# EAGLE design usb-module (EAGLE 7.5.0)
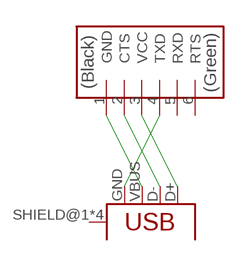
[diagram p0: schematic, sheet 1]

## Parts
U$1  USB_MINIB  [USB_MINIB]
U$3  FTDI-SMD-HEADER  [1X06SMD]

## Nets
N$1: U$1.GND U$3.4(TXD)
N$2: U$1.VBUS U$3.1(GND)
N$3: U$1.D- U$3.2(CTS)
N$4: U$1.D+ U$3.3(VCC)
Unconnected: U$1.SHIELD@1(SHIELD) U$1.SHIELD@2(SHIELD) U$1.SHIELD@3(SHIELD) U$1.SHIELD@4(SHIELD) U$3.5(RXD) U$3.6(RTS)

## Library data of the parts
U$1 = fab:USB_MINIB
U$3 = fab:FTDI-SMD-HEADER

## Board
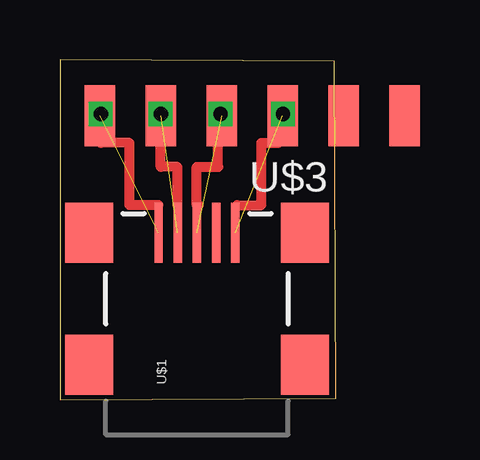
[diagram p1: board, top side]

Size 11.5 x 14.15 mm. Coordinates in mm from the lower left corner, seen from the top.
Outline: 0,0 11.5,0.05 11.45,14.1 0,14.15 0,0
Copper layers (1*16): Top 0.035mm / dielectric 1.5mm / Bottom 0.035mm
Design rules "default": minimum track width 10mil, minimum drill 24mil, track to track 8mil, track to pad 8mil, pad to pad 8mil, via to via 8mil, smd to smd 8mil, copper to edge 40mil, drill to drill 8mil, minimum pad ring 10mil, minimum via ring 8mil, stop-mask expansion 4mil, vias tented up to drill 0mil, thermal gap 10mil

### Footprints (pad centres in the part's own frame; a part is rotated, then mirrored left to right if it is on the bottom)
USB_MINIB = smd 2.5 x 0.35: D+ 3.77,0; D- 3.77,0.8; GND 3.77,-1.6; ID 3.77,-0.8; VBUS 3.77,1.6 | smd 2.5 x 2: SHIELD@1 -1.73,-4.5; SHIELD@2 -1.73,4.5; SHIELD@3 3.77,4.5; SHIELD@4 3.77,-4.5
1X06SMD = smd 2.54 x 1.27: 1 0,6.35; 2 0,3.81; 3 0,1.27; 4 0,-1.27; 5 0,-3.81; 6 0,-6.35

### Placement (x,y rotation side)
U$1  5.71,3.17 90 top
U$3  8.02,11.83 90 top

### Tracks (layer width: path | path; a pad name or v marks a point on that pad's centre or on a via)
N$1  (1 unrouted)
N$2  (1 unrouted)
N$3  (1 unrouted)
N$4  (1 unrouted)
N$5
  Top 0.406: 4.1,8.1 2.9,8.1 2.9,10.7 1.7,10.7 1.7,11.7
N$6
  Top 0.406: 4.9,8.1 4.9,9.7 4.2,9.7 4.2,11.7
N$7
  Top 0.406: 5.8,8.1 5.7,8.1 5.7,9.7 6.6,9.7 6.6,11.3
N$8
  Top 0.406: 7.4,8.1 8.4,8.1 8.4,10.7 9.1,10.7 9.1,10.8
N$9  (via drill 0.6)
  other vias: 1.7,11.9
N$10  (via drill 0.6)
  other vias: 4.2,11.9
N$11  (via drill 0.6)
  other vias: 6.7,11.9
N$12  (via drill 0.6)
  other vias: 9.3,11.9